# EAGLE design untitled (EAGLE 7.7.0)
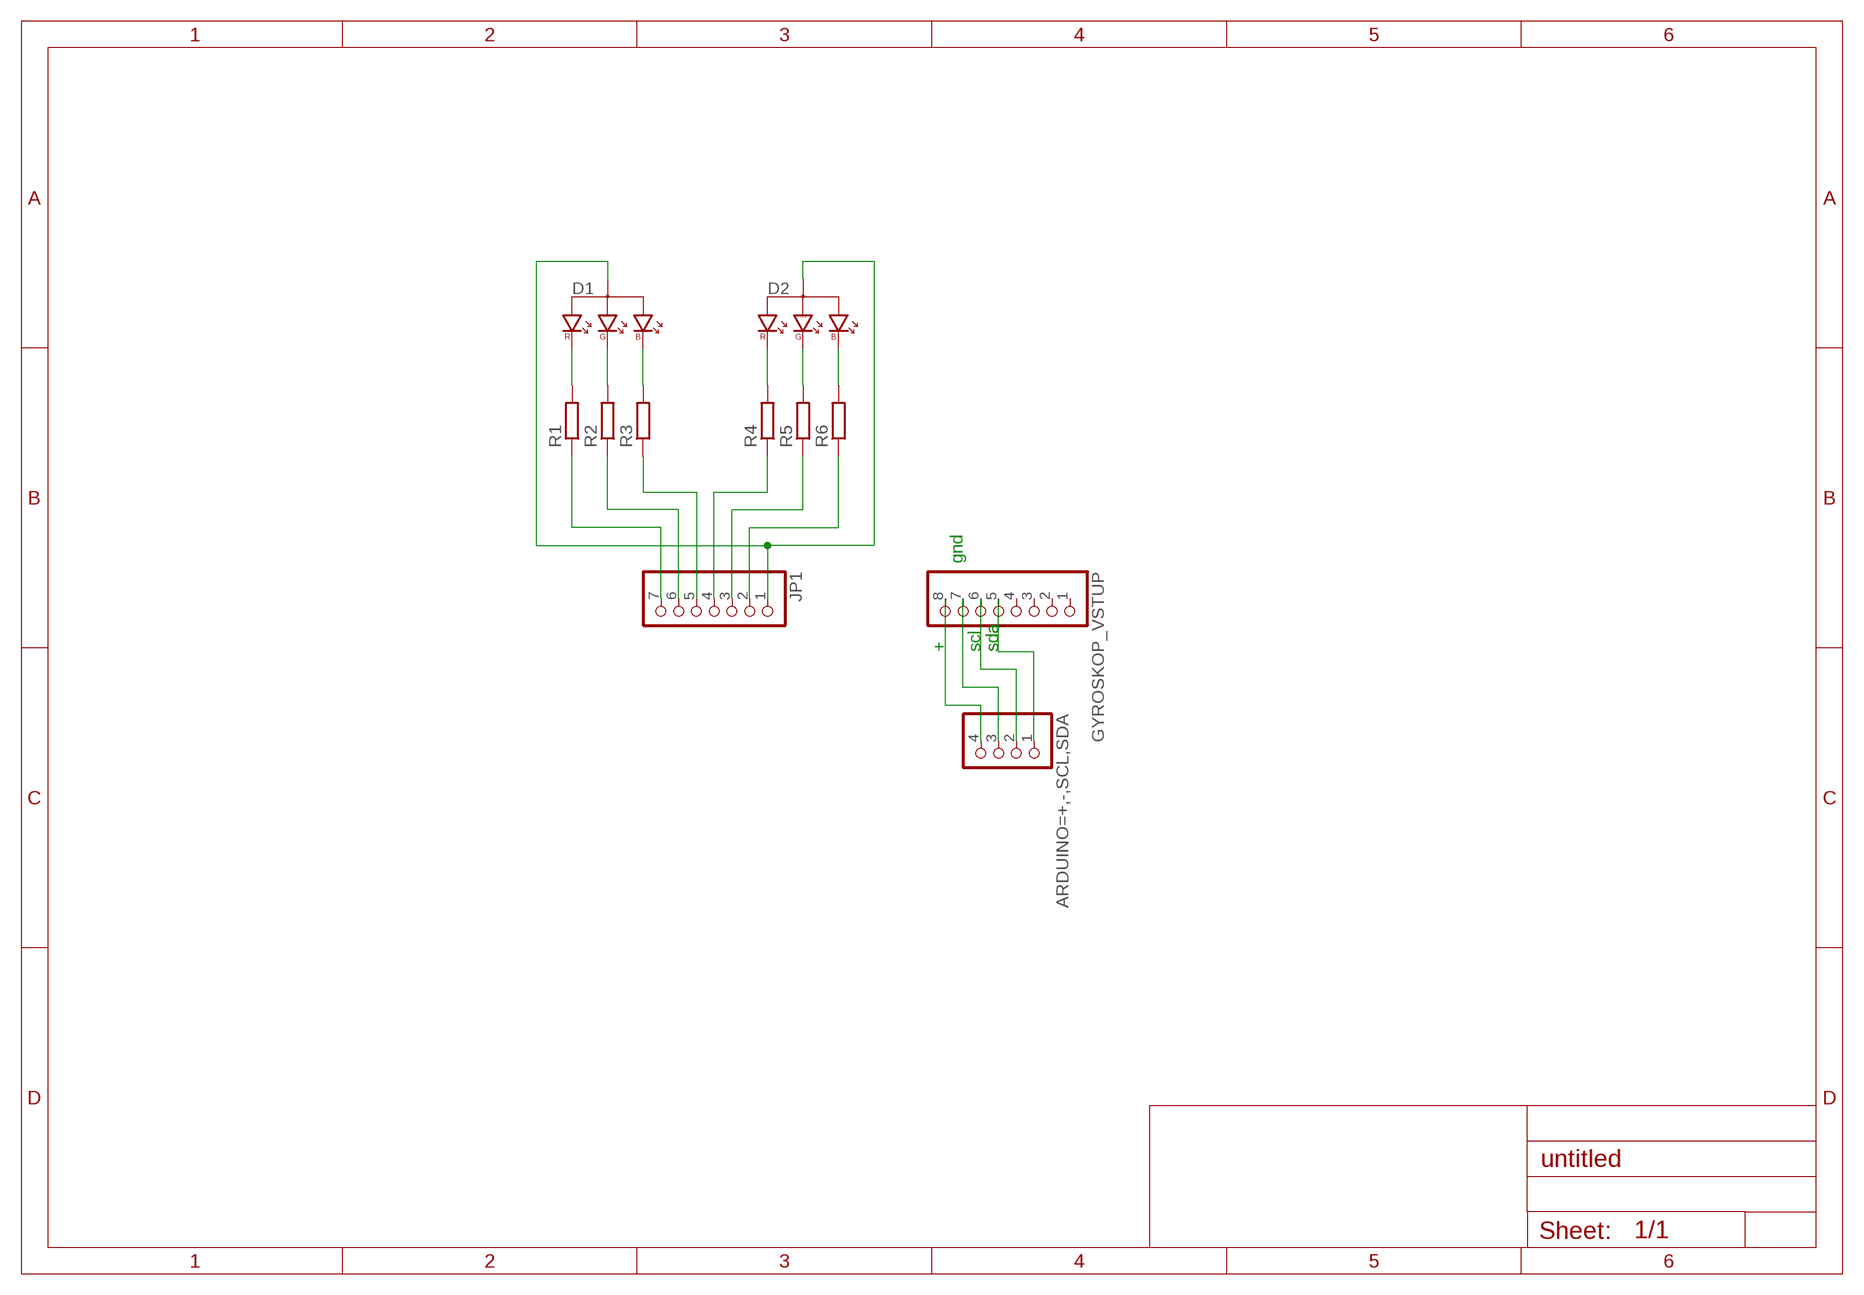
[diagram p0: schematic, sheet 1]

## Parts
ARDUINO=+,-,SCL,SDA  PINHD-1X4  [1X04]
D1  LED_RGB  [LED_5-RGB]
D2  LED_RGB  [LED_5-RGB]
GYROSKOP_VSTUP  PINHD-1X8  [1X08]
JP1  PINHD-1X7  [1X07]
R1  R-EU_0207/10  [0207/10]
R2  R-EU_0207/10  [0207/10]
R3  R-EU_0207/10  [0207/10]
R4  R-EU_0207/10  [0207/10]
R5  R-EU_0207/10  [0207/10]
R6  R-EU_0207/10  [0207/10]

## Nets
N$1: D1.1(R) R1.2
N$2: D1.3(G) R2.2
N$3: D1.4(B) R3.2
N$4: JP1.5 R3.1
N$5: JP1.6 R2.1
N$6: JP1.7 R1.1
N$7: D1.2(A) D2.2(A) JP1.1
N$8: JP1.4 R4.1
N$9: JP1.3 R5.1
N$10: JP1.2 R6.1
N$11: D2.1(R) R4.2
N$12: D2.3(G) R5.2
N$13: D2.4(B) R6.2
N$14: ARDUINO=+,-,SCL,SDA.4 GYROSKOP_VSTUP.8
N$15: ARDUINO=+,-,SCL,SDA.3 GYROSKOP_VSTUP.7
N$16: ARDUINO=+,-,SCL,SDA.2 GYROSKOP_VSTUP.6
N$17: ARDUINO=+,-,SCL,SDA.1 GYROSKOP_VSTUP.5
Unconnected: GYROSKOP_VSTUP.1 GYROSKOP_VSTUP.2 GYROSKOP_VSTUP.3 GYROSKOP_VSTUP.4

## Notes on the sheet
- gnd
- + | scl | sda

## Library data of the parts
ARDUINO=+,-,SCL,SDA = pinhead:PINHD-1X4: PIN HEADER
D1 D2 = #PaJa_31:LED_RGB: LED dioda - RGB - trojbarevna - 4 vyvody, spol. Anoda
GYROSKOP_VSTUP = pinhead:PINHD-1X8: PIN HEADER
JP1 = pinhead:PINHD-1X7: PIN HEADER
R1-R6 = rcl:R-EU_: RESISTOR, European symbol

## Board
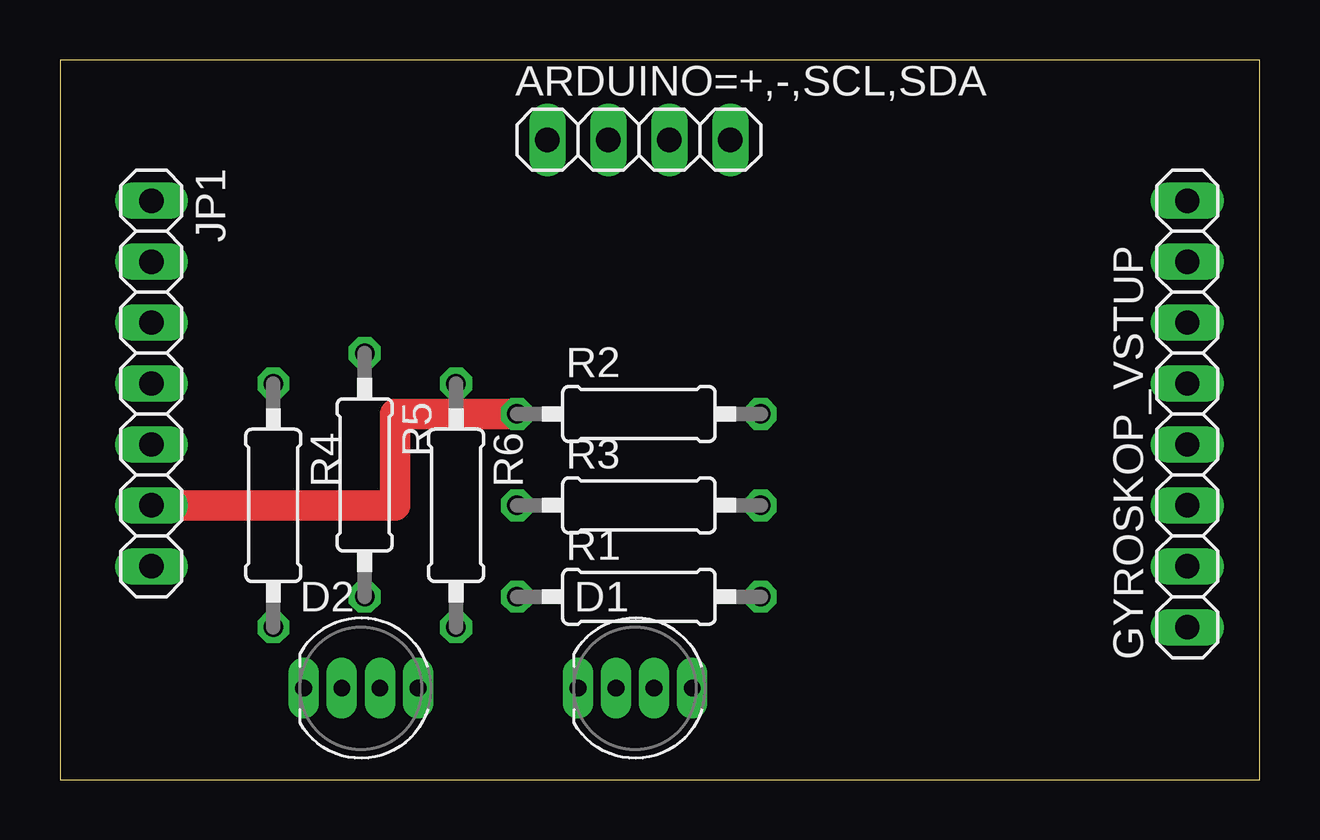
[diagram p1: board, top side]
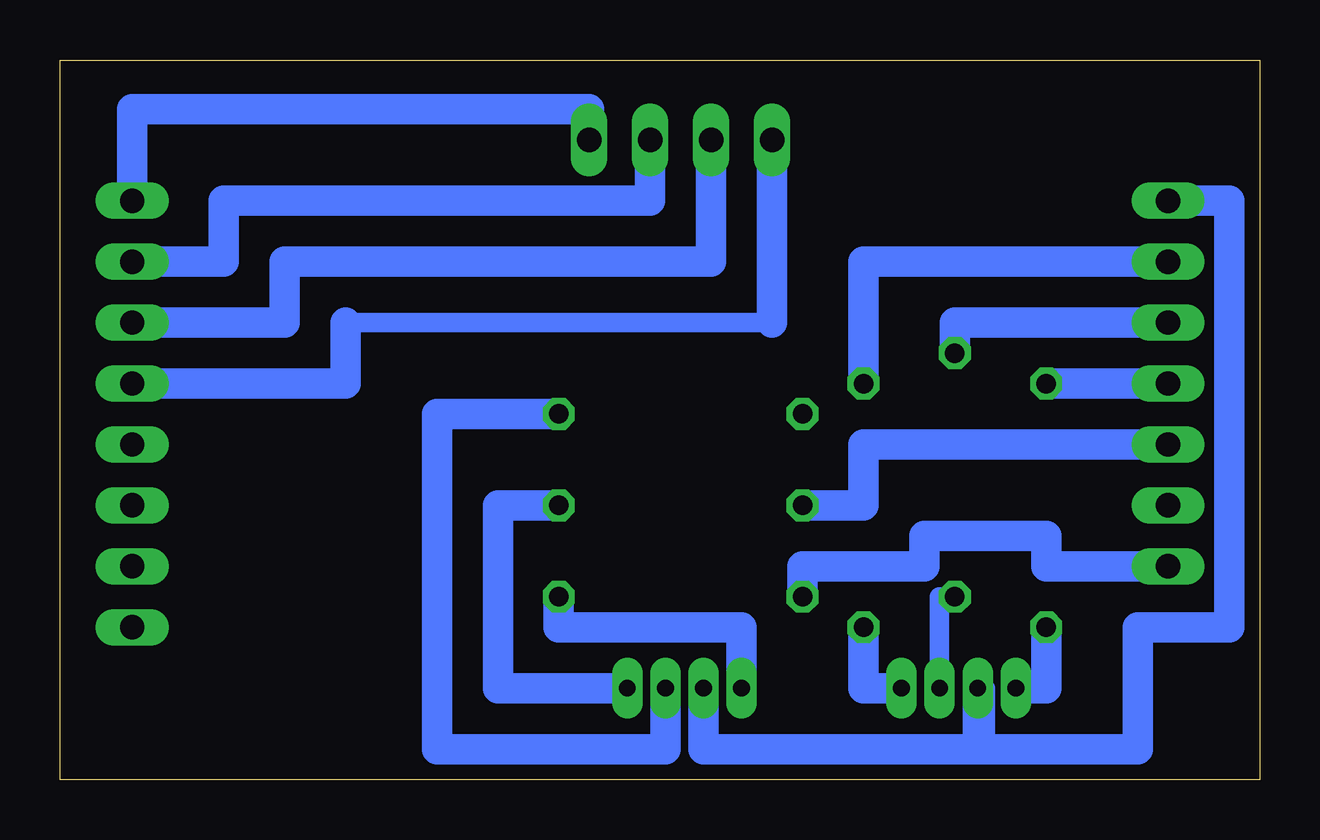
[diagram p2: board, bottom side, seen from below]

Size 50 x 30 mm. Coordinates in mm from the lower left corner, seen from the top.
Outline: 0,0 50,0 50,30 0,30 0,0
Copper layers (1*16): Top 0.035mm / dielectric 1.5mm / Bottom 0.035mm
Design rules "default": minimum track width 10mil, minimum drill 24mil, track to track 8mil, track to pad 8mil, pad to pad 8mil, via to via 8mil, smd to smd 8mil, copper to edge 40mil, drill to drill 8mil, minimum pad ring 10mil, minimum via ring 8mil, stop-mask expansion 4mil, vias tented up to drill 0mil, thermal gap 10mil

### Footprints (pad centres in the part's own frame; a part is rotated, then mirrored left to right if it is on the bottom)
1X04 = drill 1.016 long: 1 -3.81,0; 2 -1.27,0; 3 1.27,0; 4 3.81,0
LED_5-RGB = drill 0.7 pad 1.27 long: 1 -2.54,0; 2 -0.953,0; 3 0.635,0; 4 2.223,0
1X08 = drill 1.016 long: 1 -8.89,0; 2 -6.35,0; 3 -3.81,0; 4 -1.27,0; 5 1.27,0; 6 3.81,0; 7 6.35,0; 8 8.89,0
1X07 = drill 1.016 long: 1 -7.62,0; 2 -5.08,0; 3 -2.54,0; 4 0,0; 5 2.54,0; 6 5.08,0; 7 7.62,0
0207/10 = drill 0.813 octagon: 1 -5.08,0; 2 5.08,0

### Placement (x,y rotation side)
ARDUINO=+,-,SCL,SDA  24.13,26.67 0 top
D1  24.13,3.81 0 top
D2  12.7,3.81 0 top
GYROSKOP_VSTUP  46.99,15.24 90 top
JP1  3.81,16.51 270 top
R1  24.13,7.62 0 top
R2  24.13,15.24 0 top
R3  24.13,11.43 0 top
R4  8.89,11.43 270 top
R5  12.7,12.7 270 top
R6  16.51,11.43 270 top

### Tracks (layer width: path | path; a pad name or v marks a point on that pad's centre or on a via)
N$1
  Bottom 1.27: D1.1 21.59,6.35 29.21,6.35 R1.2
N$2
  Bottom 1.27: R2.2 34.29,15.24 34.29,1.27 24.77,1.27 D1.3
N$3
  Bottom 1.27: D1.4 31.75,3.81 31.75,11.43 R3.2
N$4
  Bottom 1.27: R3.1 16.51,11.43 16.51,13.97 JP1.5
N$5
  Top 1.27: R2.1 13.97,15.24 13.97,11.43 JP1.6
N$6
  Bottom 1.27: R1.1 19.05,8.89 13.97,8.89 13.97,10.16 8.89,10.16 8.89,8.89 JP1.7
N$7
  Bottom 0.813: D2.2 11.43,3.81 11.43,1.27
  Bottom 1.27: 11.75,1.27 11.43,1.27 5.08,1.27 5.08,6.35 1.27,6.35 1.27,24.13 JP1.1 | 11.75,1.27 D2.2 | 11.75,1.27 23.18,1.27 D1.2
N$8
  Bottom 1.27: R4.1 JP1.4
N$9
  Bottom 1.27: JP1.3 12.7,19.05 R5.1
N$10
  Bottom 1.27: R6.1 16.51,21.59 JP1.2
N$11
  Bottom 1.27: D2.1 8.89,3.81 R4.2
N$12
  Bottom 0.813: R5.2 13.34,7.62 D2.3
N$13
  Bottom 1.27: D2.4 16.51,3.81 R6.2
N$14
  Bottom 1.27: ARDUINO=+,-,SCL,SDA.4 27.94,27.94 46.99,27.94 GYROSKOP_VSTUP.8
N$15
  Bottom 1.27: ARDUINO=+,-,SCL,SDA.3 25.4,24.13 43.18,24.13 43.18,21.59 GYROSKOP_VSTUP.7
N$16
  Bottom 1.27: GYROSKOP_VSTUP.6 40.64,19.05 40.64,21.59 22.86,21.59 ARDUINO=+,-,SCL,SDA.2
N$17
  Bottom 0.813: 38.1,19.05 20.32,19.05
  Bottom 1.27: GYROSKOP_VSTUP.5 38.1,16.51 38.1,19.05 | 20.32,19.05 ARDUINO=+,-,SCL,SDA.1